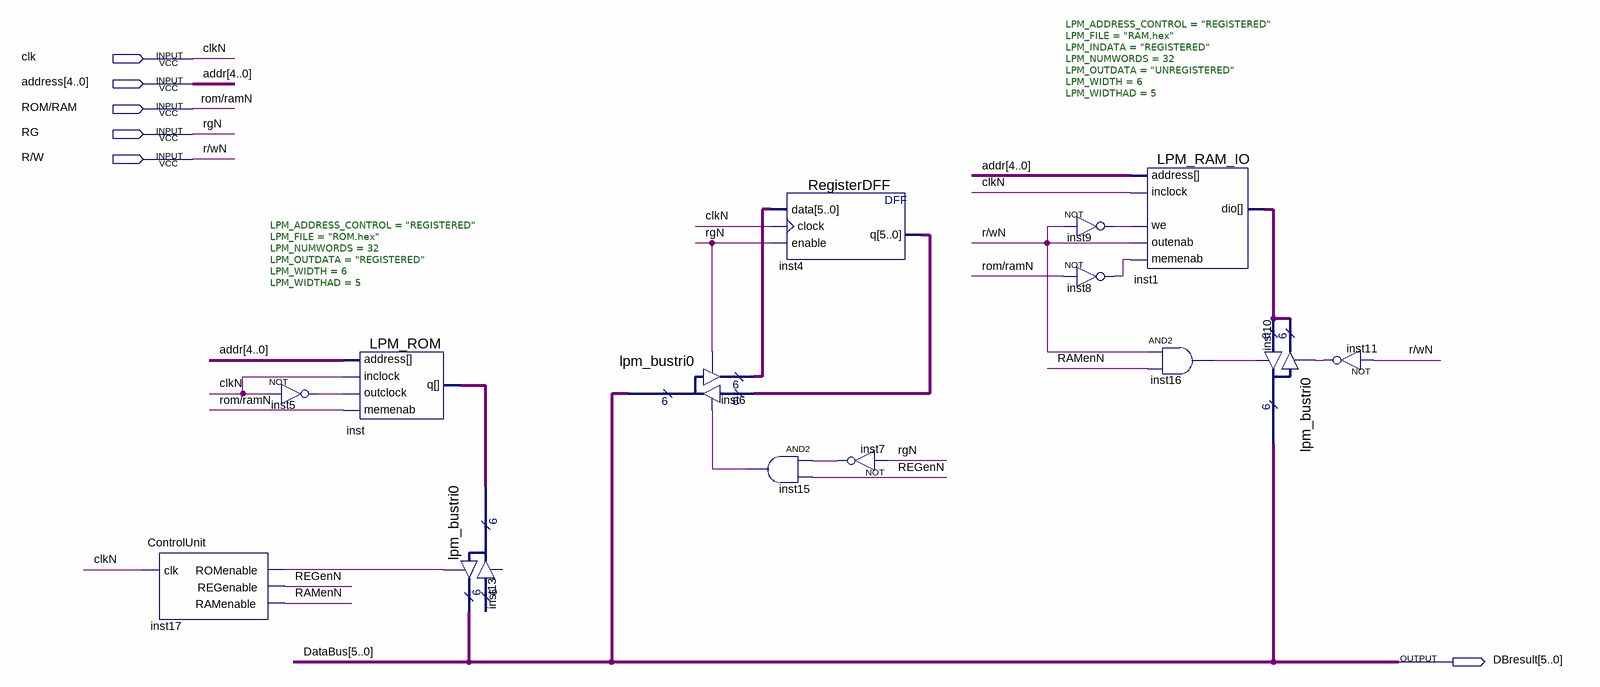
[diagram p0: schematic sheet]
// Quartus schematic lab3.bdf as structural Verilog: 14 symbols, 6 pins
module lab3 (
  input  clk,
  input  [4:0] address,
  input  \ROM/RAM ,
  input  RG,
  input  \R/W ,
  output [5:0] DBresult
);

  wire inst5_out, inst7_out, inst8_out, inst9_out, inst11_out, inst15_out, inst16_out, inst17_romenable,
       RAMenN, REGenN;
  wire [5:0] inst1_dio, inst4_q, inst6_result, inst_q;

  ControlUnit inst17 (.clk(clk), .ROMenable(inst17_romenable), .REGenable(REGenN), .RAMenable(RAMenN));
  not inst5 (inst5_out, clk);
  LPM_ROM #(.LPM_ADDRESS_CONTROL("REGISTERED"), .LPM_FILE("ROM.hex"), .LPM_NUMWORDS(32), .LPM_OUTDATA("REGISTERED"), .LPM_WIDTH(6), .LPM_WIDTHAD(5)) inst (
    .address(address), .inclock(clk), .outclock(inst5_out), .memenab(\ROM/RAM ), .q(inst_q));
  lpm_bustri0 inst13 (.enabletr(inst17_romenable), .result(DBresult), .tridata(inst_q));  // open: enabledt, data
  lpm_bustri0 inst6 (.enabledt(inst15_out), .data(inst4_q), .enabletr(RG), .result(inst6_result), .tridata(DBresult));
  and inst15 (inst15_out, inst7_out, REGenN);
  RegisterDFF inst4 (.data(inst6_result), .clock(clk), .enable(RG), .q(inst4_q));
  not inst7 (inst7_out, RG);
  not inst9 (inst9_out, \R/W );
  not inst8 (inst8_out, \ROM/RAM );
  LPM_RAM_IO #(.LPM_ADDRESS_CONTROL("REGISTERED"), .LPM_FILE("RAM.hex"), .LPM_INDATA("REGISTERED"), .LPM_NUMWORDS(32), .LPM_OUTDATA("UNREGISTERED"), .LPM_WIDTH(6), .LPM_WIDTHAD(5)) inst1 (
    .address(address), .memenab(inst8_out), .inclock(clk), .we(inst9_out), .outenab(\R/W ), .dio(inst1_dio));
  and inst16 (inst16_out, \R/W , RAMenN);
  lpm_bustri0 inst10 (
    .enabledt(inst16_out), .data(inst1_dio), .enabletr(inst11_out), .result(inst1_dio), .tridata(DBresult));
  not inst11 (inst11_out, \R/W );

  // Other names for the same wires on the sheet: addr[4:0] = address; clkN = clk; DataBus[5:0] = DBresult;
  //   r/wN = \R/W ; rgN = RG; rom/ramN = \ROM/RAM 
endmodule
